# Altium project PMR_for_R124_v2.PrjPcb (part 1 of 5)
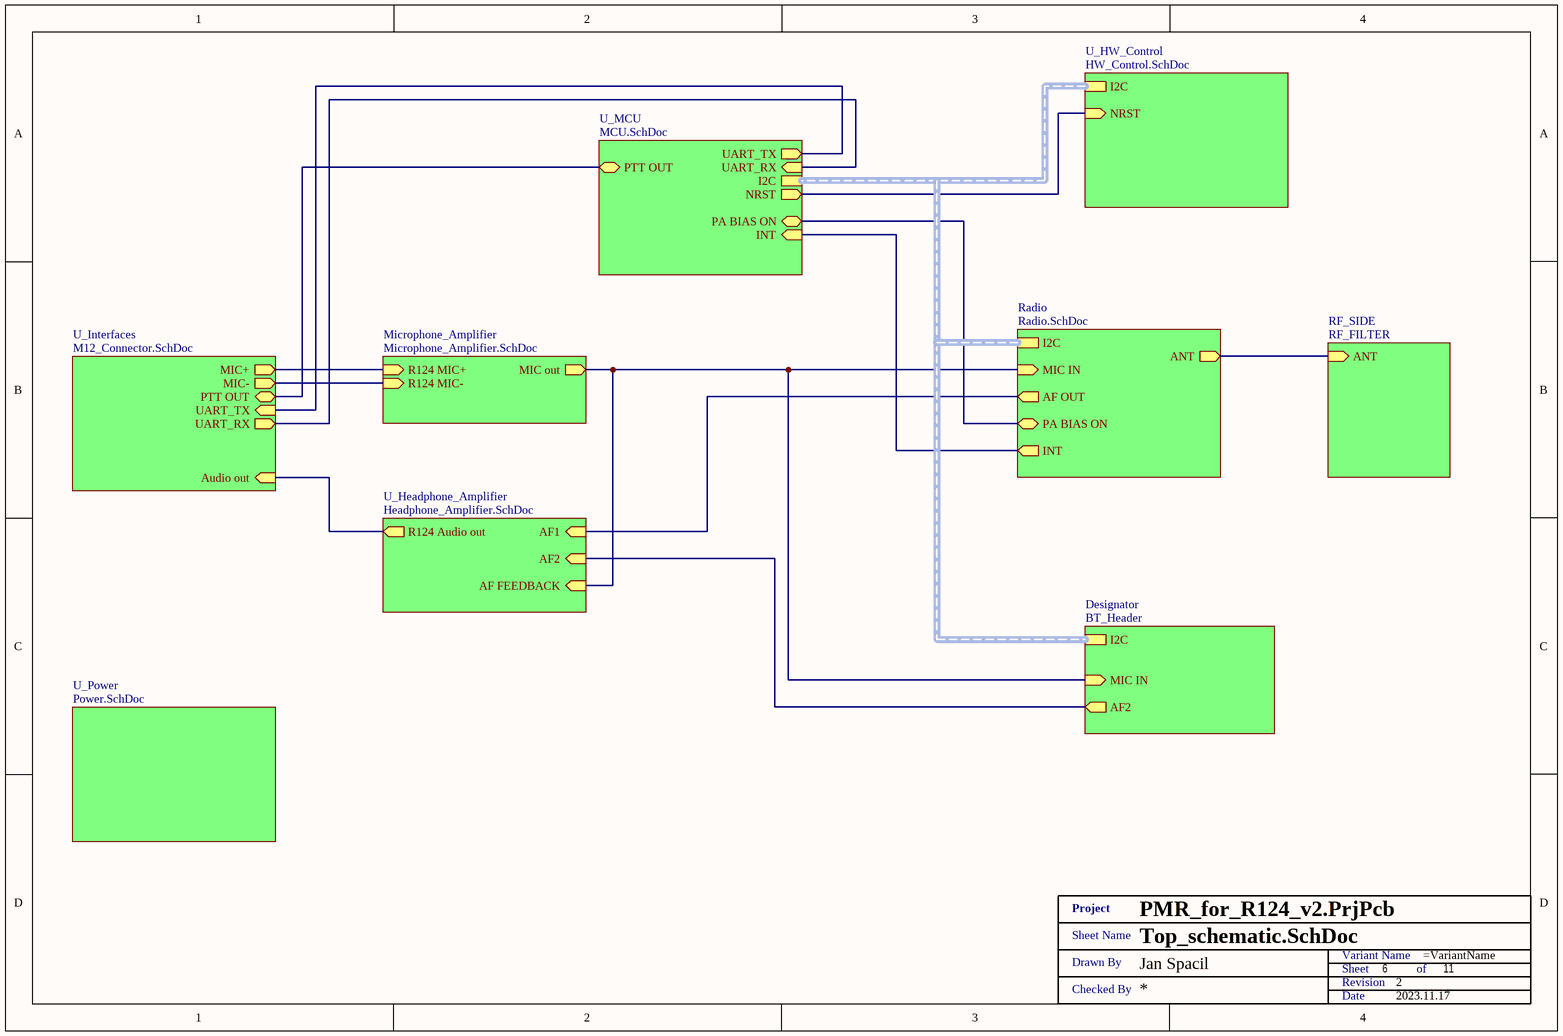
[diagram p0: Top_schematic.SchDoc]
Date: 2023.11.17; DrawnBy: Jan Spacil; Revision: 2
11 sheets, 218 parts. Net scope: hierarchical (ports join the sheet entries above them; power ports are global).
Board file: PMR_for_R124_v2.PcbDoc
Sheets:
  Top_schematic.SchDoc
    Microphone_Amplifier = Microphone_Amplifier.SchDoc
    RF_SIDE = RF_FILTER.SchDoc
    U_MCU = MCU.SchDoc
    U_Interfaces = M12_Connector.SchDoc
    U_Power = Power.SchDoc
    U_HW_Control = HW_Control.SchDoc
    U_Headphone_Amplifier = Headphone_Amplifier.SchDoc
    Designator = BT_Header.SchDoc
    Radio = Radio.SchDoc
      PA = Power_Amplifier.SchDoc

## Sheet Top_schematic.SchDoc
size A4; DocumentNumber: 6; SheetNumber: 1; SheetTotal: 11

### Parts
(Parts that share a designator on the sheet are numbered #1, #2 ... from top to bottom, then left to right.)
XX?#1  Title 1  (value not drawn)  (graphical)

### Sub-sheets
Designator = BT_Header: I2C, AF2 (out), MIC IN (in)
Microphone_Amplifier = Microphone_Amplifier.SchDoc: R124 MIC+ (in), R124 MIC- (in), MIC out (out)
Radio = Radio.SchDoc: I2C (harness I2C), AF OUT (out), MIC IN (in), PA BIAS ON (bidir), ANT (out), INT (out)
RF_SIDE = RF_FILTER: ANT (in)
U_Headphone_Amplifier = Headphone_Amplifier.SchDoc: AF1 (in), R124 Audio out (out), AF2 (in), AF FEEDBACK (in)
U_HW_Control = HW_Control.SchDoc: I2C (harness I2C), NRST (in)
U_Interfaces = M12_Connector.SchDoc: MIC+ (out), MIC- (out), Audio out (in), PTT OUT (bidir), UART_TX (in), UART_RX (out)
U_MCU = MCU.SchDoc: UART_TX (out), UART_RX (in), PTT OUT (bidir), I2C, NRST (out), PA BIAS ON (bidir), INT (in)
U_Power = Power.SchDoc: no entries

### Nets
INT: sheet U_MCU/INT, sheet Radio/INT
MIC OUT: sheet Microphone_Amplifier/MIC out, sheet U_Headphone_Amplifier/AF FEEDBACK, sheet Designator/MIC IN, sheet Radio/MIC IN
NRST: sheet U_MCU/NRST, sheet U_HW_Control/NRST
PA BIAS ON: sheet U_MCU/PA BIAS ON, sheet Radio/PA BIAS ON
PTT OUT: sheet U_MCU/PTT OUT, sheet U_Interfaces/PTT OUT
UART_RX: sheet U_MCU/UART_RX, sheet U_Interfaces/UART_RX
UART_TX: sheet U_MCU/UART_TX, sheet U_Interfaces/UART_TX
NetC29_1: sheet Microphone_Amplifier/R124 MIC-, sheet U_Interfaces/MIC-
NetC29_2: sheet Microphone_Amplifier/R124 MIC+, sheet U_Interfaces/MIC+
NetC42_2: sheet U_Interfaces/Audio out, sheet U_Headphone_Amplifier/R124 Audio out
NetC44_1: sheet U_Headphone_Amplifier/AF1, sheet Radio/AF OUT
NetJ10_2: sheet U_Headphone_Amplifier/AF2, sheet Designator/AF2
NetR38_1: sheet RF_SIDE/ANT, sheet Radio/ANT

### Buses and harness runs
harness sheet Designator/I2C = sheet Radio/I2C = sheet U_HW_Control/I2C = sheet U_MCU/I2C

### Notes on the sheet
- (in symbol Title 1) Project; Sheet Name; Variant Name; Drawn By; Sheet; of; Revision; Checked By; Date

## Sheet Microphone_Amplifier.SchDoc
size A3; DocumentNumber: 4; SheetNumber: 5; SheetTotal: 11
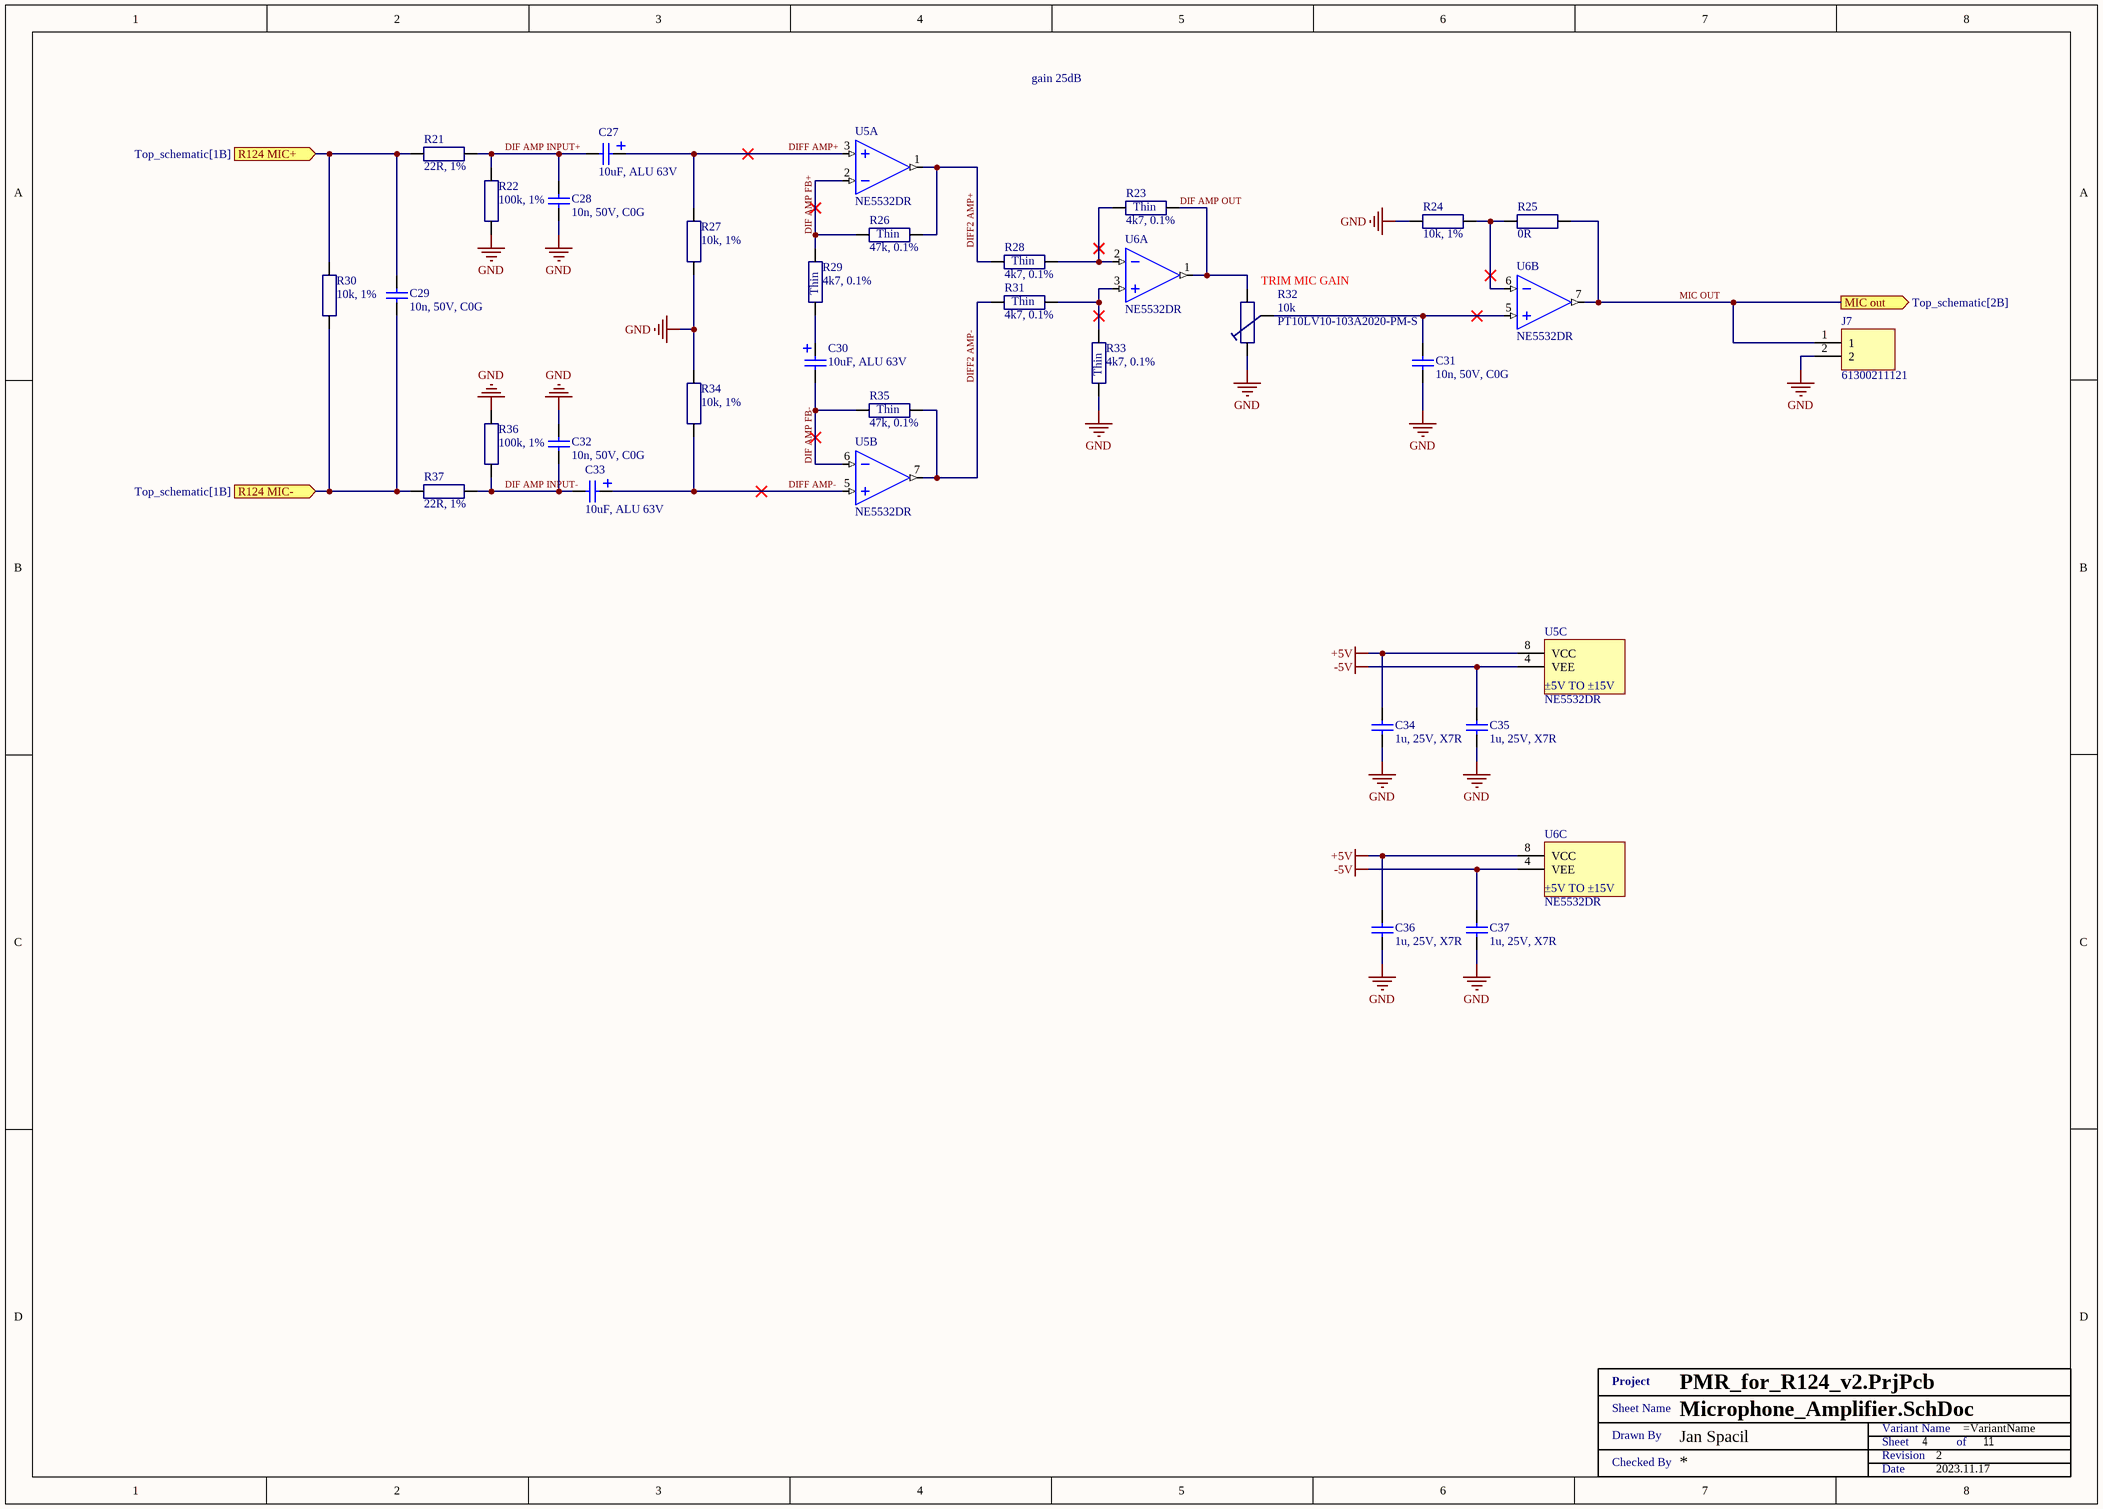
[diagram p1: Microphone_Amplifier.SchDoc]

### Parts
(Parts that share a designator on the sheet are numbered #1, #2 ... from top to bottom, then left to right.)
C27  10uF, ALU 63V  [WCAP-ATLI_5x11x2]
C28  10n, 50V, C0G  [SMD0603]
C29  10n, 50V, C0G  [SMD0603]
C30  10uF, ALU 63V  [WCAP-ATLI_5x11x2]
C31  10n, 50V, C0G  [SMD0603]
C32  10n, 50V, C0G  [SMD0603]
C33  10uF, ALU 63V  [WCAP-ATLI_5x11x2]
C34  1u, 25V, X7R  [SMD0603]
C35  1u, 25V, X7R  [SMD0603]
C36  1u, 25V, X7R  [SMD0603]
C37  1u, 25V, X7R  [SMD0603]
J7  61300211121  [Header 2 2.54mm]
R21  22R, 1%  [SMD0603 - R]
R22  100k, 1%  [SMD0603 - R]
R23  4k7, 0.1%  [SMD0603 - R]
R24  10k, 1%  [SMD0603 - R]
R25  0R  [SMD0603 - R]
R26  47k, 0.1%  [SMD0603 - R]
R27  10k, 1%  [SMD0603 - R]
R28  4k7, 0.1%  [SMD0603 - R]
R29  4k7, 0.1%  [SMD0603 - R]
R30  10k, 1%  [SMD0603 - R]
R31  4k7, 0.1%  [SMD0603 - R]
R32  10k  [V10]
R33  4k7, 0.1%  [SMD0603 - R]
R34  10k, 1%  [SMD0603 - R]
R35  47k, 0.1%  [SMD0603 - R]
R36  100k, 1%  [SMD0603 - R]
R37  22R, 1%  [SMD0603 - R]
U5  NE5532DR  [SOIC08]  (parts A,B,C of 3)
U6  NE5532DR  [SOIC08]  (parts A,B,C of 3)
XX?#2  Title 1  (value not drawn)  (graphical)

### Ports
MIC out (out, see Top_schematic[2B]), R124 MIC+ (in, see Top_schematic[1B]), R124 MIC- (in, see Top_schematic[1B])

### Nets
+5V: C34.2 C36.2 U5.8(VCC) U6.8(VCC)
-5V: C35.2 C37.2 U5.4(VEE) U6.4(VEE)
GND: C28.1 C31.1 C32.2 C34.1 C35.1 C36.1 C37.1 J7.2 R22.1 R24.1 R27.1 R32.3 R33.1 R34.1 R36.2
DIF AMP FB+: R26.1 R29.2 U5.2(-IN_A)
DIF AMP FB-: C30.2 R35.1 U5.6(-IN_B)
DIF AMP INPUT+: C27.2 C28.2 R21.2 R22.2
DIF AMP INPUT-: C32.1 C33.2 R36.1 R37.2
DIF AMP OUT: R23.2 R32.1 U6.1(OUT_A)
DIFF2 AMP+: R26.2 R28.1 U5.1(OUT_A)
DIFF2 AMP-: R31.1 R35.2 U5.7(OUT_B)
DIFF AMP+: C27.1 R27.2 U5.3(+IN_A)
DIFF AMP-: C33.1 R34.2 U5.5(+IN_B)
MIC OUT: J7.1 R25.2 U6.7(OUT_B) ; port MIC out
NetC29_1: C29.1 R30.1 R37.1 ; port R124 MIC-
NetC29_2: C29.2 R21.1 R30.2 ; port R124 MIC+
NetC30_1: C30.1 R29.1
NetC31_2: C31.2 R32.2 U6.5(+IN_B)
NetR23_1: R23.1 R28.2 U6.2(-IN_A)
NetR24_2: R24.2 R25.1 U6.6(-IN_B)
NetR31_2: R31.2 R33.2 U6.3(+IN_A)

### Notes on the sheet
- gain 25dB
- (near R32) TRIM MIC GAIN
- (in symbol NE5532DR, part C) ±5V TO ±15V
- (in symbol RT0603BRB074K7L) Thin
- (in symbol RT0603BRD0747KL) Thin
- (in symbol Title 1) Project; Sheet Name; Variant Name; Drawn By; Sheet; of; Revision; Checked By; Date

### Library data of the parts
C27 C30 C33 = 860080772001: WURTH ELEKTRONIK - 860080772001 - CAP, ALU ELEC, 10UF, 63V, RADIAL; Ripple Current: 135mA @ 100kHz; Capacitance: 10u; Manufacturer: WURTH ELEKTRONIK; Manufacturer Part Number: 860080772001; RoHS: YES; Stock 1: 553; Pricing 1: 1=0.0957, 3=0.091, 5=0.0863, 10=0.0825, 20=0.0786, 50=0.0692, 250=0.0647, 500=0.0564 (GBP); ComponentLink1URL: http://www.farnell.com/datasheets/1879798.pdf; ComponentLink1Description: http://www.farnell.com/datasheets/1879798.pdf; Voltage Rating: 63V; Stock 3: 2136; Pricing 3: 1=0.62, 50=0.335, 100=0.289, 250=0.259, 500=0.235, 1500=0.202, 7500=0.182, 15000=0.178 (GBP); ComponentLink2URL: http://www.farnell.com/datasheets/2065186.pdf; ComponentLink2Description: http://www.farnell.com/datasheets/2065186.pdf; Supplier 1: Mouser; Supplier Part Number 1: 710-860080772001; Supplier 2: Farnell; Supplier Part Number 2: 2465955; Supplier 3: Digi-Key; Supplier Part Number 3: 732-9121-1-ND
C28 C29 C31 C32 = GRM1885C1H103JA01D: Multilayer Ceramic Capacitors MLCC - SMD/SMT 0603 50VDC 10000pF 5% C0G; Manufacturer: Murata Electronics; Type: Chip Multilayer Ceramic Capacitor for General Purpose; Capacitance - nF: 10 nF; Class: Class 1; CNHTS: 8532241000; Dielectric: C0G (NP0); TARIC: 8532240000; Supplier 1: Mouser; Supplier Part Number 1: 81-GRM1885C1H103JA1D; Manufacturer Part Number: GRM1885C1H103JA01D; RoHS: RoHS Compliant; Category: Multilayer Ceramic Capacitors MLCC - SMD/SMT; Stock 1: 217291; Pricing 1: 1=0.183, 10=0.129, 100=0.065, 500=0.045, 1000=0.039, 4000=0.030, 8000=0.027, 24000=0.025 (EUR); Capacitance: 10n; Height: 0.8 mm; Length: 1.6 mm; Package / Case: 0603 (1608 metric); Packaging: Cut Tape; Product: General Type MLCCs; Series: GRM; Termination Style: SMD/SMT; Tolerance: 5 %; Voltage Rating DC: 50 VDC; Width: 0.8 mm; Brand: Murata Electronics; Capacitance - pF: 10000 pF; Case Code - in: 0603; Case Code - mm: 1608; HTS Code: 8532240020; Maximum Operating Temperature: + 125 C; Minimum Operating Temperature: - 55 C; Product Type: Ceramic Capacitors; Standard Pack Qty: 4000; Subcategory: Capacitors; Termination: Standard; RoHS - Mouser: Y; Minimum Order Quantity: 1; Reeling: True; ComponentLink1URL: http://www.mouser.com/datasheet/2/281/murata_03052018_GRM_Series_1-1310166.pdf; ComponentLink1Description: http://www.mouser.com/datasheet/2/281/murata_03052018_GRM_Series_1-1310166.pdf; Supplier 2: Farnell; Supplier Part Number 2: 2456107
C34-C37 = CGA3E1X7R1E105K080AC: CAP CER 1UF 25V X7R 0603; Manufacturer: TDK Corporation; Tolerance: ±10%; Manufacturer Part Number: CGA3E1X7R1E105K080AC; RoHS: RoHS Compliant; Category: Capacitors; Stock 1: 109509; Pricing 1: 1=0.2, 10=0.135, 100=0.0686, 500=0.04696, 1000=0.04154 (USD); Packaging: Cut Tape (CT); Part Status: Active; Voltage - Rated: 25V; Temperature Coefficient: X7R; Operating Temperature: -55°C ~ 125°C; Features: -; Ratings: AEC-Q200; Applications: Automotive; Failure Rate: -; Mounting Type: Surface Mount, MLCC; Package / Case: 0603 (1608 Metric); Size / Dimension: 0.063" L x 0.032" W (1.60mm x 0.80mm); Height - Seated (Max): -; Thickness (Max): 0.035" (0.90mm); Lead Spacing: -; Lead Style: -; ComponentLink1URL: https://product.tdk.com/info/en/catalog/datasheets/mlcc_automotive_general_en.pdf; ComponentLink1Description: https://product.tdk.com/info/en/catalog/datasheets/mlcc_automotive_general_en.pdf; Capacitance: 1u; Supplier 1: Mouser; Supplier Part Number 1: 810-CGA3E1X7R1E105K; Supplier 2: Farnell; Supplier Part Number 2: 2346962; Supplier 3: Digi-Key; Supplier Part Number 3: 445-6931-1-ND
J7 = 61300211121: CONN HEADER 2 POS 2.54; Manufacturer: Wurth Electronics Inc.; Pitch - Mating: 0.100" (2.54mm); Number of Positions: 2; Number of Positions Loaded: All; Style: Board to Board or Cable; Shrouding: Unshrouded; Contact Length - Mating: 0.236" (6.00mm); Contact Length - Post: 0.118" (3.00mm); Overall Contact Length: 0.454" (11.54mm); Material Flammability Rating: UL94 V-0; Current Rating: 3A; Voltage Rating: 250V; Manufacturer Part Number: 61300211121; RoHS: RoHS Compliant; Category: Connectors, Interconnects; Stock 1: 164911; Pricing 1: 1=0.13, 10=0.106, 25=0.088, 50=0.074, 100=0.067, 1000=0.061 (USD); Packaging: Bulk; Part Status: Active; Connector Type: Header; Contact Type: Male Pin; Number of Rows: 1; Row Spacing - Mating: -; Mounting Type: Through Hole; Termination: Solder; Fastening Type: Push-Pull; Insulation Height: 0.100" (2.54mm); Contact Shape: Square; Contact Finish - Mating: Gold; Contact Finish Thickness - Mating: -; Contact Finish - Post: -; Contact Material: Copper Alloy; Insulation Material: Polybutylene Terephthalate (PBT); Features: -; Operating Temperature: -40°C ~ 125°C; Ingress Protection: -; Insulation Color: Black; Mated Stacking Heights: -; Contact Finish Thickness - Post: -; Applications: -; ComponentLink1URL: https://katalog.we-online.de/em/datasheet/6130xx11121.pdf; ComponentLink1Description: https://katalog.we-online.de/em/datasheet/6130xx11121.pdf; Supplier 1: Mouser; Supplier Part Number 1: 710-61300211121; Supplier 2: Farnell; Supplier Part Number 2: 2356153; Supplier 3: Digi-Key; Supplier Part Number 3: 732-5315-ND
R21 R37 = RC0603FR-0722RL: YAGEO (PHYCOMP) - RC0603FR-0722RL - RES, THICK FILM, 22R, 1%, 0.1W, 0603; Voltage Rating: 50; Resistor Case Style: 0603 [1608 Metric]; Power Rating: 100; Product Range: RC Series; Temperature Coefficient: ± 100; SVHC: No SVHC (20-Jun-2016); External Depth: 0.45; External Length / Height: 1.6; External Width: 0.8; Full Power Rating Temperature: 70; No. of Pins: 2; Reel Quantity: 5000; Resistor Mounting: Surface Mount Device; Voltage Rating V DC: 50V<!--FANDB--><div class="features-and-benefits-container"><div class="features-and-benefits-desc-container"><span class="features-and-benefits-container-desc">SMD Chip Resistor, Thick Film, 22 ohm, 50 V, 0603 [1608 Metric], 100 mW, ± 1%, RC Series</span></div><div class="features-and-benefits-description"><span class="features-benefits-value">The Yageo RC_L series resistors are general purpose thick film chip resistors with lead free terminations made by thick film process. The resistance range includes E24 and E96 decade values from 1ohm to 100Mohm. These resistors are constructed on top of a high grade ceramic body.</span></div><div class="features-and-benefits-list"><ul class="features-and-benefits-list-list"><li class="features-and-benefits-list-item">EIA 0075, 0100, 0201, 0402, 0603, 0805, 1206, 1210, 1218, 2010, 2512 case sizes available</li><li class="features-and-benefits-list-item">Small chip sizes save PCB space</li><li class="features-and-benefits-list-item">Rated voltage range of 10V to 200V</li><li class="features-and-benefits-list-item">Maximum power rating of 2W</li><li class="features-and-benefits-list-item">Available in ±0.1%, ±0.5%, ±1% and ±5% tolerance</li><li class="features-and-benefits-list-item">High component and equipment reliability</li><li class="features-and-benefits-list-item">Forbidden materials are not used in products/production</li><li class="features-and-benefits-list-item">-55°C to 155°C temperature range for RC0402 to RC2512 and -55°C to 125°C for RC0075 to RC0201; Manufacturer: YAGEO (PHYCOMP); Manufacturer Part Number: RC0603FR-0722RL; RoHS: YES; Stock 1: 33025; Pricing 1: 10=0.0102, 100=0.0068, 500=0.0051, 1000=0.0041, 2500=0.0034 (GBP); Resistance: 22R; Resistance Tolerance: ± 1%; Packaging: Cut Tape; Resistor Element Material: Thick Film; Automotive Qualification Standard: -; MSL: MSL 1 - Unlimited; Operating Temperature Max: 155; Operating Temperature Min: -55; Operating Temperature Range: -55°C to +155; Temperature Coeff. +: 100; Temperature Coeff. -: 100; Tolerance +: 1%; Tolerance -: 1%; ComponentLink1URL: http://www.farnell.com/datasheets/2167052.pdf; ComponentLink1Description: http://www.farnell.com/datasheets/2167052.pdf; ComponentLink2URL: http://www.farnell.com/cad/1555248.zip; ComponentLink2Description: http://www.farnell.com/cad/1555248.zip; Supplier 1: Mouser; Supplier Part Number 1: 603-RC0603FR-0722RL; Supplier 2: Farnell; Supplier Part Number 2: 9238280; Supplier 3: Digi-Key; Supplier Part Number 3: 311-22.0HRCT-ND
R22 R36 = RC0603FR-07100KL: RES SMD 100K OHM 1% 1/10W 0603; Manufacturer: Yageo; Power (Watts): 0.1W, 1/10W; Temperature Coefficient: ±100ppm/°C; Manufacturer Part Number: RC0603FR-07100KL; RoHS: RoHS Compliant; Category: Resistors; Stock 1: 14618646; Pricing 1: 1=0.1, 10=0.015, 100=0.006, 1000=0.00268, 2500=0.00233 (USD); Packaging: Cut Tape (CT); Part Status: Active; Tolerance: ±1%; Composition: Thick Film; Features: Moisture Resistant; Operating Temperature: -55°C ~ 155°C; Package / Case: 0603 (1608 Metric); Supplier Device Package: 0603; Size / Dimension: 0.063" L x 0.032" W (1.60mm x 0.80mm); Height - Seated (Max): 0.022" (0.55mm); Failure Rate: -; ComponentLink1URL: http://www.yageo.com/documents/recent/PYu-RC_Group_51_RoHS_L_8.pdf; ComponentLink1Description: http://www.yageo.com/documents/recent/PYu-RC_Group_51_RoHS_L_8.pdf; Resistance: 100k; Supplier 1: Mouser; Supplier Part Number 1: 603-RC0603FR-07100KL; Supplier 2: Farnell; Supplier Part Number 2: 9238727; Supplier 3: Digi-Key; Supplier Part Number 3: 311-100KHRCT-ND
R23 R28 R29 R31 R33 = RT0603BRB074K7L: Res Thin Film 0603 4.7K Ohm 0.1% 0.1W(1/10W) ±10ppm/C Molded SMD Paper T/R; Manufacturer: Yageo; Voltage Rating: 75V; Resistance: 4.7kR; Power Rating: 100mW; Temperature Coefficient: 10ppm/°C; Supplier 1: Mouser; Supplier Part Number 1: 603-RT0603BRB074K7L; Manufacturer Part Number: RT0603BRB074K7L; RoHS: Yes; Category: Chip SMD Resistors; Stock 1: 3590; Pricing 1: 1=0.58000, 10=0.41700, 50=0.41700, 100=0.23600, 1000=0.19100, 10000=0.15800 (USD); Case/Package: 0603; Case Code (Metric): 1608; Case Code (Imperial): 0603; Min Operating Temperature: -55°C; Max Operating Temperature: 125°C; Tolerance: 0.1%; Packaging: Tape and Reel; Resistor Type: Thin Film; Number of Terminations: 2; Termination: SMD/SMT; Max Power Dissipation: 100mW; Features: Moisture Resistant; Series: RT; Construction: Rectangular; Length: 0.063inch; Width: 0.031inch; Height: 0.022inch; Depth: 0.8mm; Military Standard: Not; RoHS Compliant: Yes; ComponentLink1URL: https://datasheet.ciiva.com/12721/pyu-rt-1-to-0-05-rohs-l-4-12721239.pdf?src-supplier=Mouser; ComponentLink1Description: https://datasheet.ciiva.com/12721/pyu-rt-1-to-0-05-rohs-l-4-12721239.pdf?src-supplier=Mouser; Supplier 2: Digi-Key; Supplier Part Number 2: YAG4447CT-ND
R24 R27 R30 R34 = RC0603FR-0710KL: YAGEO (PHYCOMP) - RC0603FR-0710KL - RES, THICK FILM, 10K, 1%, 0.1W, 0603; Voltage Rating: 50; Resistor Case Style: 0603 [1608 Metric]; Power Rating: 100; Product Range: RC Series; Temperature Coefficient: ± 100; SVHC: No SVHC (20-Jun-2016); Manufacturer: YAGEO (PHYCOMP); Manufacturer Part Number: RC0603FR-0710KL; RoHS: YES; Stock 1: 9995; Pricing 1: 5000=0.0025, 25000=0.0014, 50000=0.0013 (GBP); Resistance: 10k; Resistance Tolerance: ± 1%; Packaging: Tape & Reel; Resistor Element Material: Thick Film; Automotive Qualification Standard: -; MSL: MSL 1 - Unlimited<!--FANDB--><div class="features-and-benefits-container"><div class="features-and-benefits-desc-container"><span class="features-and-benefits-container-desc">SMD Chip Resistor, Thick Film, 10 kohm, 50 V, 0603 [1608 Metric], 100 mW, ± 1; ComponentLink1URL: http://past.yageo.com/pdf/PYu-R_Packing_6.pdf; ComponentLink1Description: http://past.yageo.com/pdf/PYu-R_Packing_6.pdf; ComponentLink2URL: http://www.farnell.com/datasheets/2167052.pdf; ComponentLink2Description: http://www.farnell.com/datasheets/2167052.pdf; Supplier 1: Mouser; Supplier Part Number 1: 603-RC0603FR-0710KL; Supplier 2: Farnell; Supplier Part Number 2: 2421850; Supplier 3: Digi-Key; Supplier Part Number 3: 311-10.0KHRCT-ND
R25 = CRCW06030000Z0EA: RES SMD 0 OHM JUMPER 1/10W 0603; Manufacturer: Vishay Dale; Power (Watts): 0.1W, 1/10W; Manufacturer Part Number: CRCW06030000Z0EA; RoHS: RoHS Compliant; Category: Resistors; Stock 1: 0; Pricing 1: 1=0.1, 10=0.028, 25=0.0204, 50=0.0154, 100=0.0114, 250=0.00868, 500=0.00694, 1000=0.00511 (USD); Packaging: Cut Tape (CT); Part Status: Active; Tolerance: Jumper; Composition: Thick Film; Features: Automotive AEC-Q200; Temperature Coefficient: -; Operating Temperature: -55°C ~ 155°C; Package / Case: 0603 (1608 Metric); Supplier Device Package: 0603; Size / Dimension: 0.063" L x 0.033" W (1.60mm x 0.85mm); Height - Seated (Max): 0.020" (0.50mm); Failure Rate: -; ComponentLink1URL: http://www.vishay.com/docs/20035/dcrcwe3.pdf; ComponentLink1Description: http://www.vishay.com/docs/20035/dcrcwe3.pdf; Resistance: 0R; Supplier 1: Mouser; Supplier Part Number 1: 71-CRCW0603-0-E3; Supplier 2: Farnell; Supplier Part Number 2: 1469739; Supplier 3: Digi-Key; Supplier Part Number 3: 541-0.0GCT-ND
R26 R35 = RT0603BRD0747KL: RES SMD 47K OHM 0.1% 1/10W 0603; Manufacturer: Yageo; Voltage Rating: 75V; Resistance: 47kR; Power Rating: 100mW; Temperature Coefficient: 25ppm/°C; Voltage Rating (DC): 50V; Supplier 1: Mouser; Supplier Part Number 1: 603-RT0603BRD0747KL; Manufacturer Part Number: RT0603BRD0747KL; RoHS: Yes; Category: Chip SMD Resistors; Stock 1: 4858; Pricing 1: 1=0.38000, 10=0.23400, 50=0.23400, 100=0.07600, 1000=0.05300, 10000=0.03800 (USD); Case/Package: 0603; Case Code (Metric): 1608; Case Code (Imperial): 0603; Contact Plating: Tin,Lead; Min Operating Temperature: -55°C; Max Operating Temperature: 125°C; Packaging: Tape and Reel; Package Quantity: 5000; Resistor Type: Thin Film; Termination: SMD/SMT; Number of Terminations: 2; Max Power Dissipation: 100mW; Features: Moisture Resistant; Series: RT; Construction: Rectangular; Length: 0.063inch; Width: 0.031inch; Height: 0.022inch; Depth: 0.8mm; Military Standard: Not; Lead Free: Lead Free; RoHS Compliant: Yes; ComponentLink1URL: https://datasheet.ciiva.com/2585/pyu-rt-1-to-0-05-rohs-l-4-2585964.pdf?src-supplier=Digi-Key; ComponentLink1Description: https://datasheet.ciiva.com/2585/pyu-rt-1-to-0-05-rohs-l-4-2585964.pdf?src-supplier=Digi-Key; ComponentLink2URL: https://datasheet.ciiva.com/46635/pyu-rt-1-to-0-05-rohs-l-5-46635309.pdf?src-supplier=Digi-Key; ComponentLink2Description: https://datasheet.ciiva.com/46635/pyu-rt-1-to-0-05-rohs-l-5-46635309.pdf?src-supplier=Digi-Key; Supplier 2: Digi-Key; Supplier Part Number 2: YAG1667CT-ND; Supplier 3: Arrow Electronics; Supplier Part Number 3: RT0603BRD0747KL
R32 = PT10LV10-103A2020-PM-S: Resistor Carbon Film Trimmer Top Adjustment 10K Ohm 20% 3/20W 1 Turn PC Pin Through Hole Bulk; Manufacturer: Amphenol; Supplier 1: Mouser; Supplier Part Number 1: 531-PT10LV113A22PMS; Stock 1: 8041; Pricing 1: 1=0.5, 10=0.451, 50=0.396, 100=0.374, 1000=0.296, 10000=0.268 (USD); Manufacturer Part Number: PT10LV10-103A2020-PM-S
U5 U6 = NE5532DR: 2-channel, 10-MHz, 26-V output swing, low-noise audio op amp 8-SOIC 0 to 70; Manufacturer: Texas Instruments; Bandwidth: 10MHz; Number of Channels: 2; Voltage Gain: 100dB; Min Dual Supply Voltage: 5V; Max Dual Supply Voltage: 15V; Output Current: 38mA; Nominal Supply Current: 16mA; Common Mode Rejection Ratio: 70dB; Slew Rate: 9V/µs; Max I/O Voltage: 4mV; Input Bias Current: 800nA; Operating Supply Current: 8mA; Dual Supply Voltage: 9V; Parameter 1: Jellybean; Supplier 1: Mouser; Supplier Part Number 1: 595-NE5532DR; Manufacturer Part Number: NE5532DR; RoHS: Yes; Category: Amplifiers - Op Amps, Buffer, Instrumentation; Pricing 1: 1=0.60000, 10=0.51400, 50=0.51400, 100=0.35600, 500=0.30100, 1000=0.23300, 2500=0.21100, 10000=0.21100 (USD); Case/Package: D; Number of Pins: 8; Contact Plating: Gold; Min Operating Temperature: 0°C; Max Operating Temperature: 70°C; Packaging: Tape and Reel; Number of Circuits: 2; Gain Bandwidth Product: 10MHz; Unity Gain Bandwidth Product: 10MHz; Package Quantity: 1; Nominal Gain Bandwidth Product: 10MHz; Input Offset Voltage (Vos): 4mV; Output Current per Channel: 38mA; Number of Elements: 2; Max Supply Voltage: 15V; Number of Amplifiers: 2; Length: 4.9mm; Width: 3.91mm; Height: 1.58mm; Radiation Hardening: No; Lead Free: Lead Free; RoHS Compliant: Yes; REACH SVHC: No SVHC; ComponentLink1URL: https://datasheet.ciiva.com/1796/ne5532-1796190.pdf?src-supplier=Digi-Key; ComponentLink1Description: https://datasheet.ciiva.com/1796/ne5532-1796190.pdf?src-supplier=Digi-Key; ComponentLink2URL: https://datasheet.ciiva.com/1796/ne5532-1796189.pdf?src-supplier=Digi-Key; ComponentLink2Description: https://datasheet.ciiva.com/1796/ne5532-1796189.pdf?src-supplier=Digi-Key; ComponentLink3URL: https://datasheet.ciiva.com/1796/ne5532-1796191.pdf?src-supplier=Digi-Key; ComponentLink3Description: https://datasheet.ciiva.com/1796/ne5532-1796191.pdf?src-supplier=Digi-Key; Supplier 2: Farnell; Supplier Part Number 2: 3117312; Supplier 3: Digi-Key; Supplier Part Number 3: 296-13622-6-ND

## Sheet RF_FILTER.SchDoc
size A4; DocumentNumber: 5; SheetNumber: 6; SheetTotal: 11
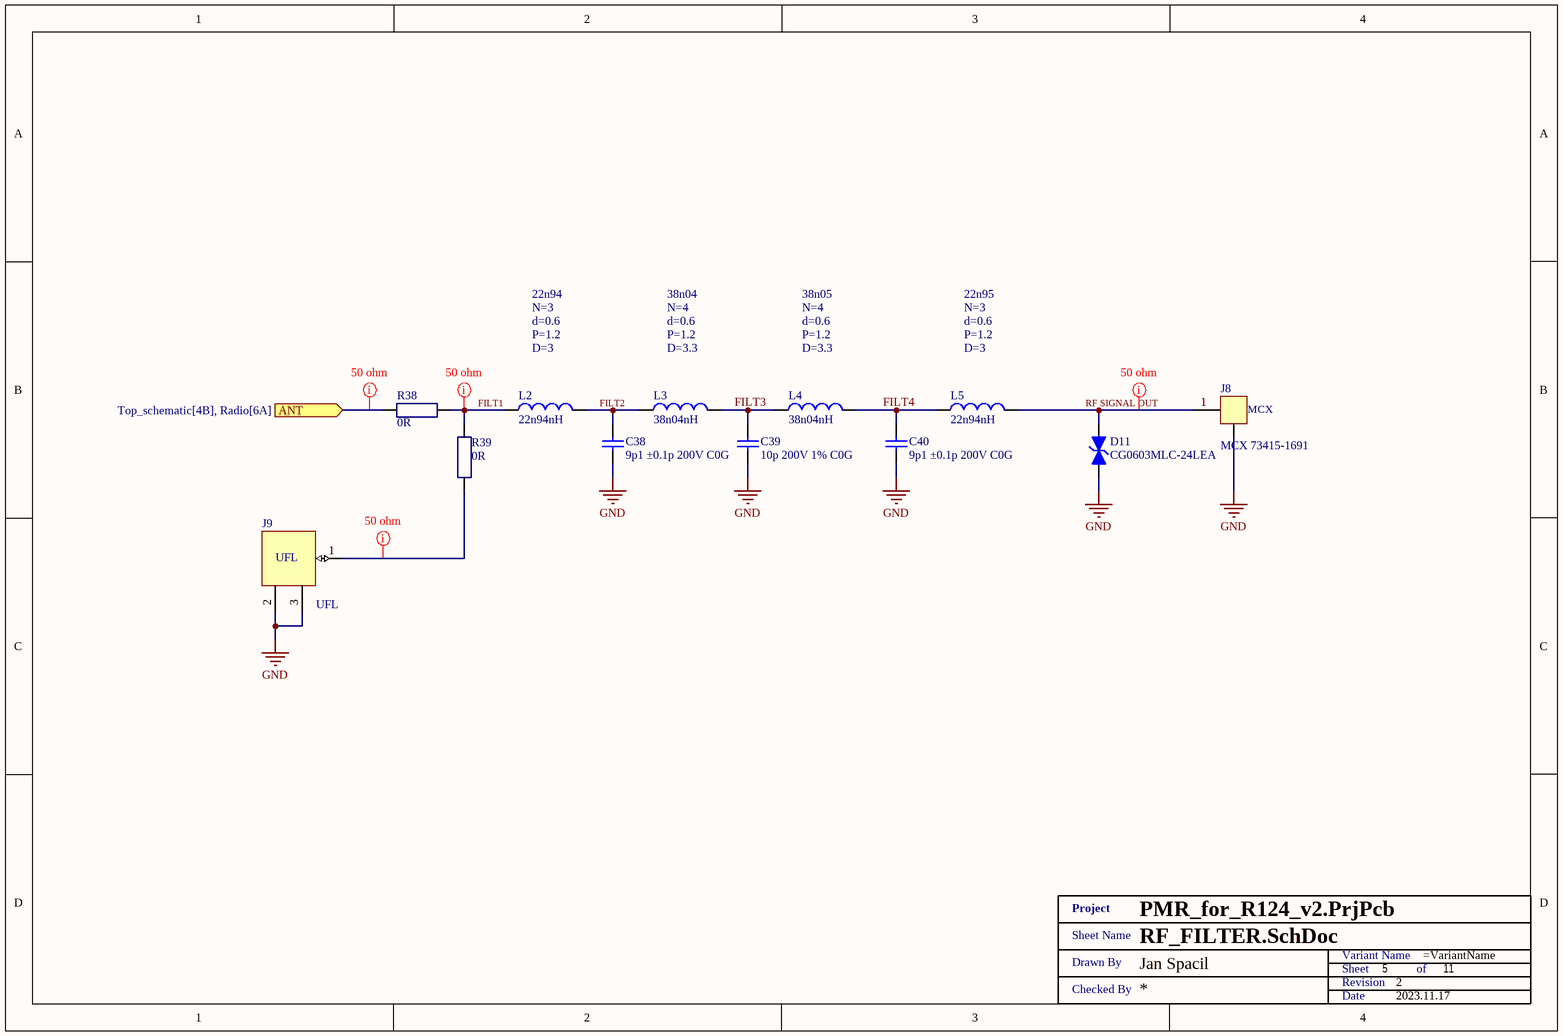
[diagram p2: RF_FILTER.SchDoc]

### Parts
(Parts that share a designator on the sheet are numbered #1, #2 ... from top to bottom, then left to right.)
C38  9p1 ±0.1p 200V C0G  [SMD0603]
C39  10p 200V 1% C0G  [SMD0603]
C40  9p1 ±0.1p 200V C0G  [SMD0603]
D11  CG0603MLC-24LEA  [SMD0603 - R]
J8  MCX 73415-1691  [MCX_SMD_vertical]
J9  UFL  [CONUFL001-SMD-T]
L2  22n94nH  [Air-Inductor-25nH]
L3  38n04nH  [Air-Inductor-40nH]
L4  38n04nH  [Air-Inductor-40nH]
L5  22n94nH  [Air-Inductor-25nH]
R38  0R  [SMD0603 - R]
R39  0R  [SMD0603 - R]
XX?#3  Title 1  (value not drawn)  (graphical)

### Ports
ANT (in, see Top_schematic[4B], Radio[6A])

### Nets
GND: C38.1 C39.1 C40.1 D11.1(A) J8.2(GND) J9.2(GND) J9.3(GND)
FILT1: L2.1 R38.2 R39.2
FILT2: C38.2 L2.2 L3.1
FILT3: C39.2 L3.2 L4.1
FILT4: C40.2 L4.2 L5.1
RF SIGNAL OUT: D11.2(K) J8.1(INPUT) L5.2
NetJ9_1: J9.1(S) R39.1
NetR38_1: R38.1 ; port ANT

### Layout directives
net class 50 ohm: FILT1, NetJ9_1, NetR38_1, RF SIGNAL OUT

### Notes on the sheet
- 22n94
- N=3
- 38n04
- N=4
- 38n05
- 22n95
- d=0.6
- P=1.2
- D=3
- D=3.3
- (in symbol Title 1) Project; Sheet Name; Variant Name; Drawn By; Sheet; of; Revision; Checked By; Date

### Library data of the parts
C38 C40 = 06032U9R1BAT2A: Cap SMD U" Series Low ESR 0603 200V C0G (NP0) 9.1pF ±0.1pF for Comm/RF/µWave Apps Ni/Sn Plated 7"T/R"; Manufacturer: Kyocera AVX; Supplier 1: Mouser; Supplier Part Number 1: 581-06032U9R1BAT2A; Manufacturer Part Number: 06032U9R1BAT2A; RoHS: Yes; Category: Ceramic Capacitors; Stock 1: 4736; Pricing 1: 1=0.3, 10=0.201, 50=0.201, 100=0.114, 1000=0.074, 10000=0.058 (USD); ComponentLink1URL: https://datasheet.ciiva.com/207/useries-207450.pdf?src-supplier=Digikey; ComponentLink1Description: https://datasheet.ciiva.com/207/useries-207450.pdf?src-supplier=Digikey; Capacitance: 9p1
C39 = 06032U100FAT2A: Cap Ceramic 10pF 200V C0G 1% Pad SMD 0603 125°C Ultra Low ESR T/R; Manufacturer: Kyocera AVX; Supplier 1: Mouser; Supplier Part Number 1: 581-06032U100FAT2A; Manufacturer Part Number: 06032U100FAT2A; RoHS: Yes; Category: Ceramic Capacitors; Stock 1: 12241; Pricing 1: 1=0.33, 10=0.227, 50=0.227, 100=0.137, 1000=0.087, 10000=0.07 (USD); ComponentLink1URL: https://datasheet.ciiva.com/219/useries-219573.pdf?src-supplier=Digi-Key; ComponentLink1Description: https://datasheet.ciiva.com/219/useries-219573.pdf?src-supplier=Digi-Key; ComponentLink2URL: https://datasheet.ciiva.com/16209/useries-16209209.pdf?src-supplier=Future+Electronics; ComponentLink2Description: https://datasheet.ciiva.com/16209/useries-16209209.pdf?src-supplier=Future+Electronics; Supplier 2: Arrow Electronics; Supplier Part Number 2: 06032U100FAT2A; Supplier 3: Newark; Supplier Part Number 3: 96Y8278; Capacitance: 10p
D11 = CG0603MLC-24LEA: ESD Suppressor ±25KV 2-Pin Case 0603 T/R; Manufacturer: Bourns; Number of Circuits: 1; Max Voltage Rating (DC): 24V; Clamping Voltage: 25V; Leakage Current: 5nA; Capacitance: 0.5pF; Element Configuration: Single; Supplier 1: Mouser; Supplier Part Number 1: 652-CG0603MLC-24LEA; Manufacturer Part Number: CG0603MLC-24LEA; RoHS: Yes; Category: Varistors; Stock 1: 8361; Pricing 1: 1=0,29000, 10=0,24400, 50=0,24400, 100=0,22700, 1000=0,16000, 10000=0,10800 (USD); Mount: Surface Mount; Case/Package: 0603; Number of Pins: 2; Contact Plating: Tin; Min Operating Temperature: -40°C; Max Operating Temperature: 85°C; Working Voltage: 24V; Packaging: Tape and Reel; Package Quantity: 5000; Length: 1.6mm; Depth: 0.8mm; Radiation Hardening: No; ComponentLink1URL: https://datasheet.ciiva.com/29507/mlc-29507976.pdf?src-supplier=Digi-Key; ComponentLink1Description: https://datasheet.ciiva.com/29507/mlc-29507976.pdf?src-supplier=Digi-Key; Supplier 2: Digi-Key; Supplier Part Number 2: CG0603MLC-24LEA-ND; Supplier 3: Arrow Electronics; Supplier Part Number 3: CG0603MLC-24LEA
J8 = 73415-1691: MOLEX - 73415-1691 - RF COAXIAL, MCX, STRAIGHT JACK, 50OHM; Connector Type: MCX Coaxial; Coaxial Termination: Surface Mount Vertical; Impedance: 50; Frequency Max: 6; Connector Mounting: PCB Mount; Contact Termination: Solder; Body Material: Brass; Body Finish: Gold; Dielectric Material: Polytetrafluoroethylene (PTFE); Center Contact Material: Beryllium Copper; Mating Cycles: 500; Manufacturer: MOLEX; Manufacturer Part Number: 73415-1691; RoHS: YES; Stock 1: 733; Pricing 1: 1=1.65, 10=1.4, 50=1.25, 100=1.13, 250=1.06, 500=0.995 (GBP); Connector Body Style: Straight Jack; Coaxial Cable Types: -; Contact Material: Beryllium Copper; Contact Plating: Gold Plated Contacts; Product Range: -; Termination Method: Surface Mount<!--FANDB--><div class="features-and-benefits-container"><div class="features-and-benefits-description"><span class="features-benefits-value">The 73415-1691 is a vertical surface-mount MCX Straight Jack Receptacle made of gold-plated brass body with gold-plated beryllium copper centre contact and a Teflon insulator.</span></div><div class="features-and-benefits-applications"><ul class="features-and-benefits-value"><li class="features-and-benefits-list-item">RF Communications</li><li class="features-and-benefits-list-item">Industrial</li></ul></div></div>; ComponentLink1URL: http://www.farnell.com/cad/1518410.pdf; ComponentLink1Description: http://www.farnell.com/cad/1518410.pdf; ComponentLink2URL: http://www.farnell.com/datasheets/2133682.pdf; ComponentLink2Description: http://www.farnell.com/datasheets/2133682.pdf; Category: Connectors, Interconnects; Stock 4: 39394; Pricing 4: 1=1.95, 10=1.765, 25=1.6572, 50=1.5854, 100=1.5133, 250=1.36916, 500=1.26106, 1000=1.0809, 2500=1.00884 (USD); Packaging: Tray; Part Status: Active; Connector Style: MCX; Shield Termination: Solder; Mounting Type: Through Hole; Mounting Feature: -; Cable Group: -; Fastening Type: Snap-On; Features: -; Housing Color: Gold; Ingress Protection: -; Includes: -; Center Contact Plating: Gold; Operating Temperature: -55°C ~ 155°C; Insertion Loss: -; ComponentLink3URL: https://www.molex.com/pdm_docs/sd/733660061_sd.pdf; ComponentLink3Description: https://www.molex.com/pdm_docs/sd/733660061_sd.pdf; Supplier 1: Mouser; Supplier Part Number 1: 538-73415-1691; Supplier 2: Farnell; Supplier Part Number 2: 1909246; Supplier 3: Digi-Key; Supplier Part Number 3: WM5559-ND; Supplier 4: Digi-Key; Supplier Part Number 4: WM5541-ND
J9 = CONUFL001-SMD-T: CONN UMC JACK STR SMD; Manufacturer: Linx Technologies Inc.; Connector Style: Ultra Miniature Coaxial; Connector Type: Jack, Male Pin; Supplier 1: Digi-Key; Supplier Part Number 1: CONUFL001-SMD-TCT-ND; Manufacturer Part Number: CONUFL001-SMD-T; RoHS: RoHS Compliant; Category: Connectors, Interconnects; Stock 1: 6423; Pricing 1: 1=0.97, 25=0.882, 100=0.826, 1000=0.742, 2500=0.63 (USD); Packaging: Cut Tape (CT); Part Status: Active; Contact Termination: -; Shield Termination: -; Impedance: -; Mounting Type: Surface Mount; Mounting Feature: -; Cable Group: -; Fastening Type: Snap-On; Features: -; Housing Color: -; Ingress Protection: -; Includes: -; Body Material: -; Body Finish: -; Center Contact Plating: -; Dielectric Material: -; Operating Temperature: -; Center Contact Material: -; Mating Cycles: -; Insertion Loss: -; ComponentLink1URL: http://media.digikey.com/pdf/Data%20Sheets/Linx%20Technologies%20PDFs/CONUFL001-SMD_T_Dwg_RevB_5-15-17.pdf; ComponentLink1Description: http://media.digikey.com/pdf/Data%20Sheets/Linx%20Technologies%20PDFs/CONUFL001-SMD_T_Dwg_RevB_5-15-17.pdf; Supplier 2: Mouser; Supplier Part Number 2: 712-CONUFL001-SMD-T
L2 L5 = Air-Inductor_20nH
L3 L4 = Air-Inductor_40nH
R38 R39 = CRCW06030000Z0EA: as R25 on sheet Microphone_Amplifier; Manufacturer Part Number: CRCW06030000Z0EA; RoHS: RoHS Compliant; Category: Resistors; Stock 1: 0; Pricing 1: 1=0.1, 10=0.028, 25=0.0204, 50=0.0154, 100=0.0114, 250=0.00868, 500=0.00694, 1000=0.00511 (USD); Packaging: Cut Tape (CT); Part Status: Active; Tolerance: Jumper; Composition: Thick Film; Features: Automotive AEC-Q200; Temperature Coefficient: -; Operating Temperature: -55°C ~ 155°C; Package / Case: 0603 (1608 Metric); Supplier Device Package: 0603; Size / Dimension: 0.063" L x 0.033" W (1.60mm x 0.85mm); Height - Seated (Max): 0.020" (0.50mm); Failure Rate: -; ComponentLink1URL: http://www.vishay.com/docs/20035/dcrcwe3.pdf; ComponentLink1Description: http://www.vishay.com/docs/20035/dcrcwe3.pdf; Resistance: 0R; Supplier 1: Mouser; Supplier Part Number 1: 71-CRCW0603-0-E3; Supplier 2: Farnell; Supplier Part Number 2: 1469739; Supplier 3: Digi-Key; Supplier Part Number 3: 541-0.0GCT-ND